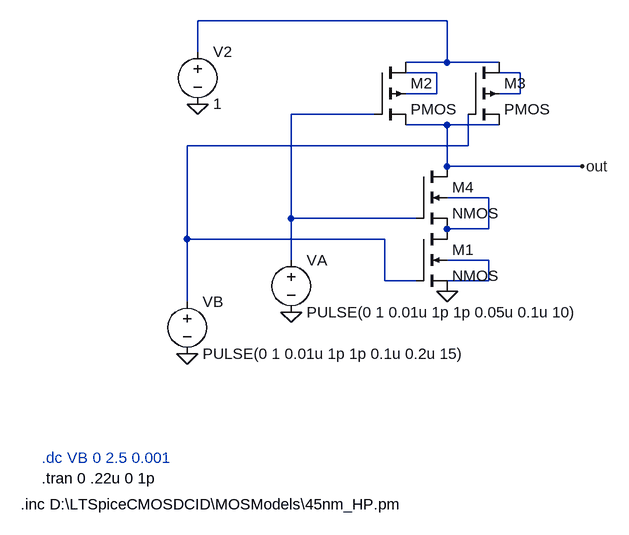
[diagram p0: schematic 45n_nand_gate.asc]
45n_nand_gate.asc, the LTspice schematic file:
Version 4
SHEET 1 2488 680
WIRE 1600 -496 1216 -496
WIRE 1216 -448 1216 -496
WIRE 1600 -432 1600 -496
WIRE 1600 -432 1536 -432
WIRE 1680 -432 1600 -432
WIRE 1584 -416 1536 -416
WIRE 1712 -416 1680 -416
WIRE 1584 -384 1584 -416
WIRE 1584 -384 1536 -384
WIRE 1712 -384 1712 -416
WIRE 1712 -384 1680 -384
WIRE 1488 -352 1360 -352
WIRE 1600 -336 1536 -336
WIRE 1680 -336 1600 -336
WIRE 1632 -304 1632 -352
WIRE 1632 -304 1200 -304
WIRE 1600 -272 1600 -336
WIRE 1808 -272 1600 -272
WIRE 1664 -224 1600 -224
WIRE 1360 -192 1360 -352
WIRE 1552 -192 1360 -192
WIRE 1664 -176 1664 -224
WIRE 1664 -176 1600 -176
WIRE 1200 -160 1200 -304
WIRE 1504 -160 1200 -160
WIRE 1360 -128 1360 -192
WIRE 1664 -128 1600 -128
WIRE 1504 -96 1504 -160
WIRE 1552 -96 1504 -96
WIRE 1664 -96 1664 -128
WIRE 1664 -96 1584 -96
WIRE 1200 -64 1200 -160
FLAG 1808 -272 out
FLAG 1200 16 0
FLAG 1360 -48 0
FLAG 1600 -80 0
FLAG 1216 -368 0
SYMBOL nmos4 1552 -176 R0
SYMATTR InstName M1
SYMATTR Value2 l=45n w=90n ad=.0.0081p as=.0.0081p pd=360n ps=360n
SYMBOL voltage 1200 -80 R0
WINDOW 123 0 0 Left 0
WINDOW 39 0 0 Left 0
SYMATTR InstName VB
SYMATTR Value PULSE(0 1 0.01u 1p 1p 0.1u 0.2u 15)
SYMBOL voltage 1216 -464 R0
WINDOW 123 0 0 Left 0
WINDOW 39 0 0 Left 0
SYMATTR InstName V2
SYMATTR Value 1
SYMBOL cmosp 1488 -432 R0
SYMATTR InstName M2
SYMATTR Value2 l=45n w=90n ad=.0.0081p as=0.0081p pd=360n ps=360n
SYMATTR Value PMOS
SYMBOL cmosp 1632 -432 R0
SYMATTR InstName M3
SYMATTR Value2 l=45n w=90n ad=.0.0081p as=0.0081p pd=360n ps=360n
SYMATTR Value PMOS
SYMBOL nmos4 1552 -272 R0
SYMATTR InstName M4
SYMATTR Value2 l=45n w=90n ad=.0.0081p as=.0.0081p pd=360n ps=360n
SYMBOL voltage 1360 -144 R0
WINDOW 123 0 0 Left 0
WINDOW 39 0 0 Left 0
SYMATTR InstName VA
SYMATTR Value PULSE(0 1 0.01u 1p 1p 0.05u 0.1u 10)
TEXT 976 176 Left 2 ;.dc VB 0 2.5 0.001
TEXT 944 248 Left 2 !.inc D:\\LTSpiceCMOSDCID\\MOSModels\\45nm_HP.pm
TEXT 976 208 Left 2 !.tran 0 .22u 0 1p

The netlist it stands for:
* 45n_nand_gate.asc
M1 N006 N005 0 N007 NMOS l=45n w=90n ad=.0.0081p as=.0.0081p pd=360n ps=360n
VB N005 0 PULSE(0 1 0.01u 1p 1p 0.1u 0.2u 15)
V2 N001 0 1
M2 N001 N004 out N002 PMOS l=45n w=90n ad=.0.0081p as=0.0081p pd=360n ps=360n
M3 N001 N005 out N003 PMOS l=45n w=90n ad=.0.0081p as=0.0081p pd=360n ps=360n
M4 out N004 N006 N006 NMOS l=45n w=90n ad=.0.0081p as=.0.0081p pd=360n ps=360n
VA N004 0 PULSE(0 1 0.01u 1p 1p 0.05u 0.1u 10)
.model NMOS NMOS
.model PMOS PMOS
.lib standard.mos
* .dc VB 0 2.5 0.001
.inc D:\LTSpiceCMOSDCID\MOSModels\45nm_HP.pm
.tran 0 .22u 0 1p
.backanno
.end